# Altium schematic sheet Arduino.SchDoc
size A4
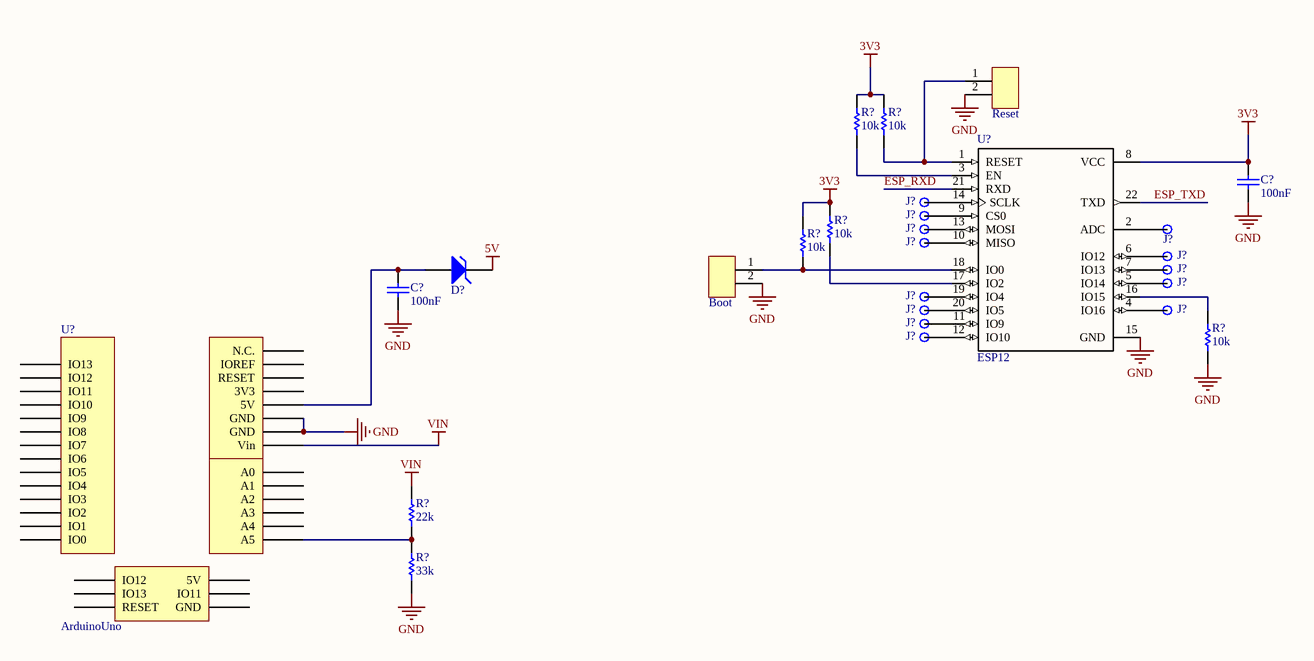
[diagram p0: Arduino.SchDoc]

## Parts
(Parts that share a designator on the sheet are numbered #1, #2 ... from top to bottom, then left to right.)
Boot  J_Header_1x2  [HEADER_1x2]  (value not drawn)
C?#1  100nF  [0805]
C?#2  100nF  [0805]
D?  MBR120VLSFT3  [SOD-123FL]  (value not drawn)
J?#1  Pin  [Pin]  (value not drawn)
J?#2  Pin  [Pin]  (value not drawn)
J?#3  Pin  [Pin]  (value not drawn)
J?#4  Pin  [Pin]  (value not drawn)
J?#5  Pin  [Pin]  (value not drawn)
J?#6  Pin  [Pin]  (value not drawn)
J?#7  Pin  [Pin]  (value not drawn)
J?#8  Pin  [Pin]  (value not drawn)
J?#9  Pin  [Pin]  (value not drawn)
J?#10  Pin  [Pin]  (value not drawn)
J?#11  Pin  [Pin]  (value not drawn)
J?#12  Pin  [Pin]  (value not drawn)
J?#13  Pin  [Pin]  (value not drawn)
R?#1  10k  [0805]
R?#2  10k  [0805]
R?#3  10k  [0805]
R?#4  10k  [0805]
R?#5  10k  [0805]
R?#6  22k  [0805]
R?#7  33k  [0805]
Reset  J_Header_1x2  [HEADER_1x2]  (value not drawn)
U?#1  ESP12  [ESP12]
U?#2  ArduinoUno  [Arduino Uno]

## Nets
3V3: C?#1.2 R?#1.2 R?#2.2 R?#3.2 R?#4.2 U?#1.8(VCC)
5V: D?.1(K)
GND: Boot.2 C?#1.1 C?#2.2 R?#5.1 R?#7.1 Reset.2 U?#1.15(GND) U?#2.GND1(GND) U?#2.GND2(GND)
VIN: R?#6.2 U?#2.Vin
ESP_RXD: U?#1.21(RXD)
ESP_TXD: U?#1.22(TXD)
NetBoot_1: Boot.1 R?#4.1 U?#1.18(IO0)
NetC?#2_1: C?#2.1 D?.2(A) U?#2.5V
NetJ?#1_1: J?#1.1 U?#1.14(SCLK)
NetJ?#2_1: J?#2.1 U?#1.9(CS0)
NetJ?#3_1: J?#3.1 U?#1.13(MOSI)
NetJ?#4_1: J?#4.1 U?#1.2(ADC)
NetJ?#5_1: J?#5.1 U?#1.10(MISO)
NetJ?#6_1: J?#6.1 U?#1.6(IO12)
NetJ?#7_1: J?#7.1 U?#1.7(IO13)
NetJ?#8_1: J?#8.1 U?#1.5(IO14)
NetJ?#9_1: J?#9.1 U?#1.19(IO4)
NetJ?#10_1: J?#10.1 U?#1.20(IO5)
NetJ?#11_1: J?#11.1 U?#1.4(IO16)
NetJ?#12_1: J?#12.1 U?#1.11(IO9)
NetJ?#13_1: J?#13.1 U?#1.12(IO10)
NetR?#1_1: R?#1.1 U?#1.3(EN)
NetR?#2_1: R?#2.1 Reset.1 U?#1.1(RESET)
NetR?#3_1: R?#3.1 U?#1.17(IO2)
NetR?#5_2: R?#5.2 U?#1.16(IO15)
NetR?#6_1: R?#6.1 R?#7.2 U?#2.A5

Not connected (* = marked no-connect by the designer): U?#2 0(IO0) 1(IO1) 2(IO2) 3(IO3) 3V3 4(IO4) 5(IO5) 6(IO6) 7(IO7) 8(IO8) 9(IO9) 10(IO10) 11(IO11) 12(IO12) 13(IO13) A0 A1 A2 A3 A4 ICSP1(IO12) ICSP2(5V) ICSP3(IO13) ICSP4(IO11) ICSP5(RESET) ICSP6(GND) IOREF NC(N.C.) RESET

## Library data of the parts
C?#1 C?#2 = C_100nF_0805: value: 100nF
D? = D_MBR120VLSFT3
J?#1-J?#13 = J_Pin
R?#1-R?#5 = R_10k_0805
R?#6 = R_33k_0805
R?#7 = R_22k_0805
U?#1 = U_ESP12
U?#2 = U_ArduinoUno